# EAGLE design USB_LCD (EAGLE 5.10)
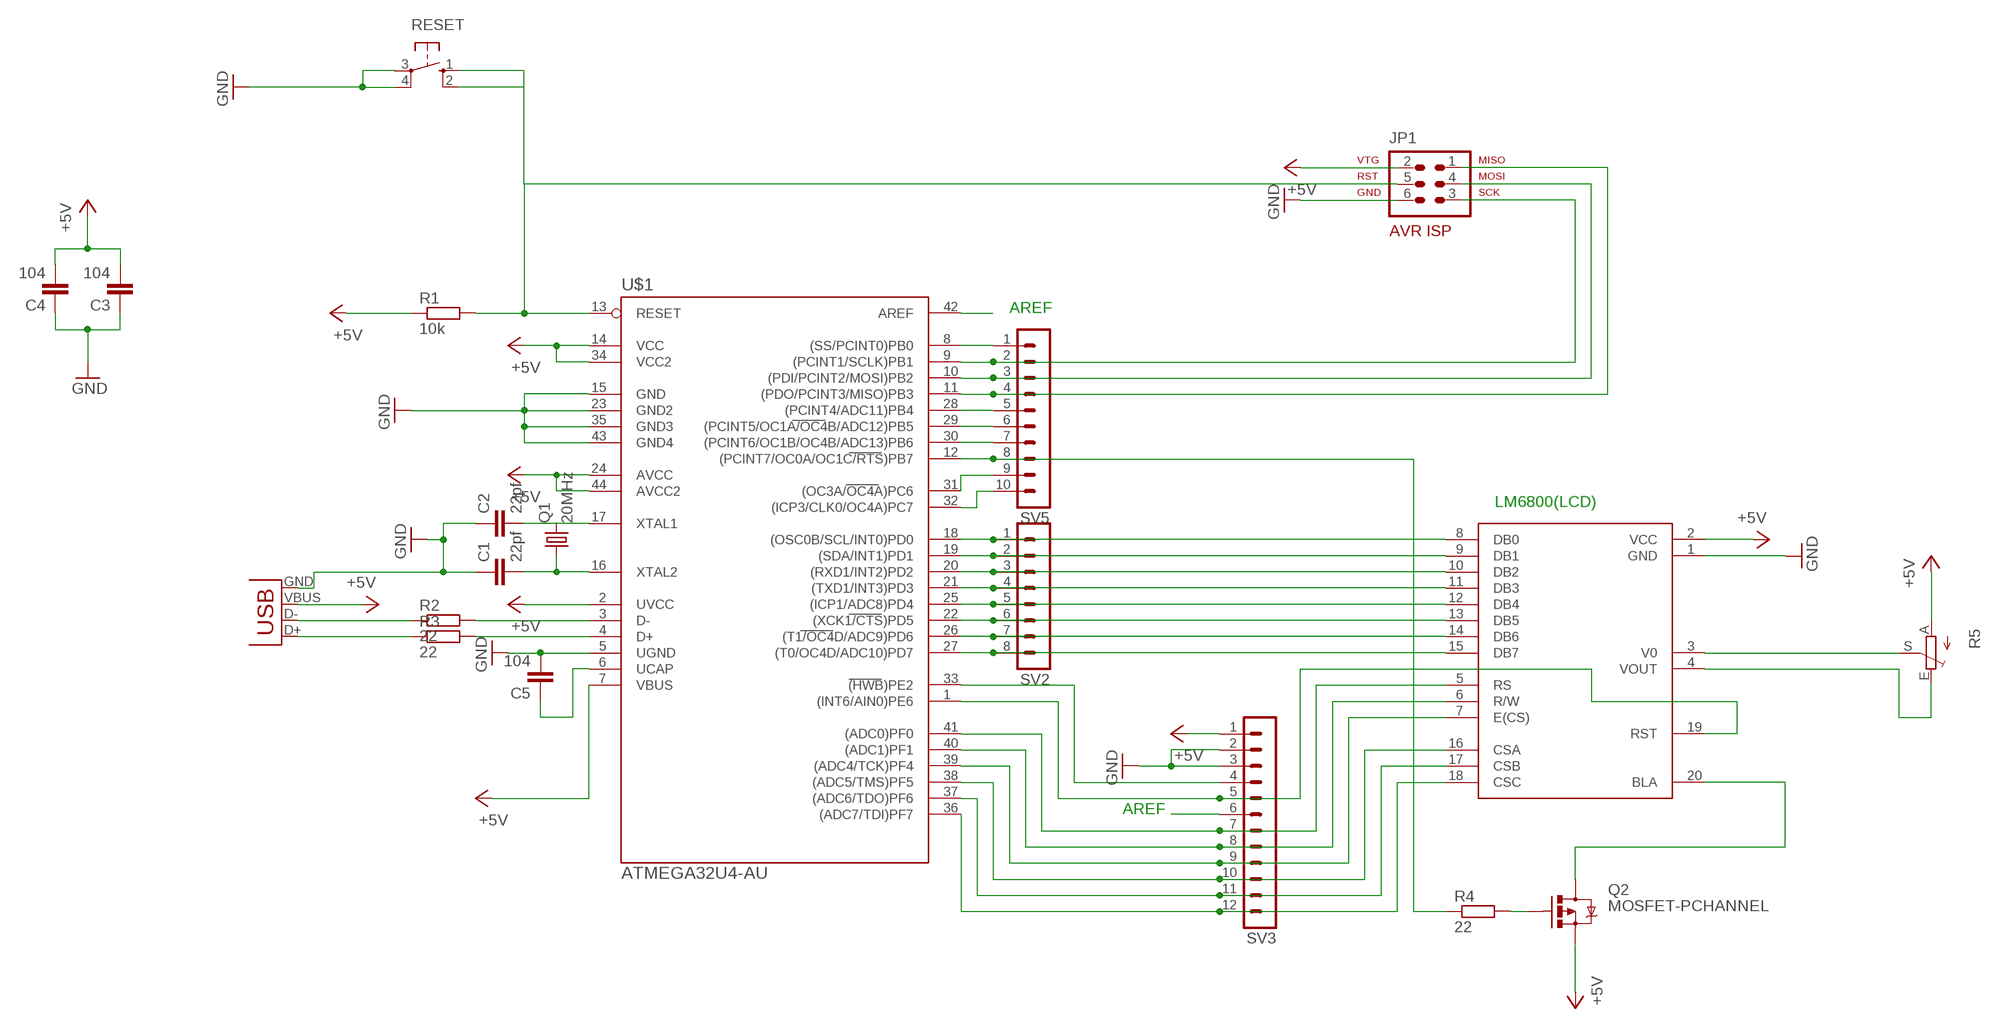
[diagram p0: schematic, sheet 1]

## Parts
C1  22pf  C5/3  [C5B3]
C2  22pf  C5/3  [C5B3]
C3  104  C5/3  [C5B3]
C4  104  C5/3  [C5B3]
C5  104  C5/3  [C5B3]
JP1  AVR-ISP-6  [AVR-ISP-6]
LM6800  LM6800  [MA10-2]
Q1  20MHz  CRYSTALHC49S  [HC49/S]
Q2  MOSFET-PCHANNEL  [SOT23]
R1  10k  R-EU_0204/7  [0204/7]
R2  22  R-EU_0204/7  [0204/7]
R3  22  R-EU_0204/7  [0204/7]
R4  22  R-EU_0204/7  [0204/7]
R5  TRIM_EU-  [3306W]
RESET  10-XX  [B3F-10XX]
SV2  MA08-1  [MA08-1]
SV3  MA12-1  [MA12-1]
SV5  MA10-1  [MA10-1]
U$1  ATMEGA32U4-AU  [TQFP44]
X1  USB-MB-H  [USB-MB-H]

## Nets
+5V: C3.2 C4.2 JP1.2 LM6800.2(VCC) Q2.2(S) R1.1 R5.A SV3.1 U$1.2(UVCC) U$1.7(VBUS) U$1.14(VCC) U$1.24(AVCC) U$1.34(VCC2) U$1.44(AVCC2) X1.VBUS
AREF: SV3.6 U$1.42(AREF)
GND: C1.1 C2.1 C3.1 C4.1 C5.2 JP1.6 LM6800.1(GND) RESET.3(P) RESET.4(P1) SV3.2 SV3.3 U$1.5(UGND) U$1.15(GND) U$1.23(GND2) U$1.35(GND3) U$1.43(GND4) X1.GND
N$1: LM6800.8(DB0) SV2.1 U$1.18((OSC0B/SCL/INT0)PD0)
N$2: LM6800.9(DB1) SV2.2 U$1.19((SDA/INT1)PD1)
N$3: LM6800.10(DB2) SV2.3 U$1.20((RXD1/INT2)PD2)
N$4: LM6800.11(DB3) SV2.4 U$1.21((TXD1/INT3)PD3)
N$5: LM6800.12(DB4) SV2.5 U$1.25((ICP1/ADC8)PD4)
N$6: LM6800.13(DB5) SV2.6 U$1.22((XCK1/CTS)PD5)
N$7: LM6800.14(DB6) SV2.7 U$1.26((T1/OC4D/ADC9)PD6)
N$8: LM6800.15(DB7) SV2.8 U$1.27((T0/OC4D/ADC10)PD7)
N$9: SV5.1 U$1.8((SS/PCINT0)PB0)
N$10: JP1.3 SV5.2 U$1.9((PCINT1/SCLK)PB1)
N$11: JP1.4 SV5.3 U$1.10((PDI/PCINT2/MOSI)PB2)
N$12: R4.1 SV5.8 U$1.12((PCINT7/OC0A/OC1C/RTS)PB7)
N$13: SV5.5 U$1.28((PCINT4/ADC11)PB4)
N$14: SV5.6 U$1.29((PCINT5/OC1A/OC4B/ADC12)PB5)
N$15: SV5.9 U$1.31((OC3A/OC4A)PC6)
N$16: JP1.5 R1.2 RESET.1(S) RESET.2(S1) U$1.13(RESET)
N$17: JP1.1 SV5.4 U$1.11((PDO/PCINT3/MISO)PB3)
N$18: R2.1 X1.D-
N$19: C2.2 Q1.2 U$1.17(XTAL1)
N$20: C1.2 Q1.1 U$1.16(XTAL2)
N$21: R3.1 X1.D+
N$22: R2.2 U$1.3(D-)
N$23: R3.2 U$1.4(D+)
N$24: SV5.7 U$1.30((PCINT6/OC1B/OC4B/ADC13)PB6)
N$25: SV5.10 U$1.32((ICP3/CLK0/OC4A)PC7)
N$26: LM6800.18(CSC) SV3.12 U$1.36((ADC7/TDI)PF7)
N$27: LM6800.17(CSB) SV3.11 U$1.37((ADC6/TDO)PF6)
N$28: LM6800.16(CSA) SV3.10 U$1.38((ADC5/TMS)PF5)
N$29: LM6800.7(E(CS)) SV3.9 U$1.39((ADC4/TCK)PF4)
N$30: LM6800.6(R/W) SV3.8 U$1.40((ADC1)PF1)
N$31: LM6800.5(RS) SV3.7 U$1.41((ADC0)PF0)
N$32: Q2.1(G) R4.2
N$33: SV3.4 U$1.33((HWB)PE2)
N$34: LM6800.4(VOUT) R5.E
N$35: LM6800.3(V0) R5.S
N$36: LM6800.20(BLA) Q2.3(D)
N$37: C5.1 U$1.6(UCAP)
N$38: LM6800.19(RST) SV3.5 U$1.1((INT6/AIN0)PE6)

## Notes on the sheet
- AREF
- LM6800(LCD)
- AREF

## Library data of the parts
C1-C5 = capacitor-wima:C: CAPACITOR naming: grid - package width
JP1 = atmel-isp:AVR-ISP-6: AVR ISP-6 Serial Programming Header
LM6800 = LM6800:LM6800: Topway LM6800 LCD (256x64)
Q1 = crystal:CRYSTAL: CRYSTAL
Q2 = SparkFun:MOSFET-PCHANNEL
R1-R4 = resistor:R-EU_: RESISTOR, European symbol
R5 = pot:TRIM_EU-: POTENTIOMETER
RESET = switch-omron:10-XX: OMRON SWITCH
SV2 = con-lstb:MA08-1: PIN HEADER
SV3 = con-lstb:MA12-1: PIN HEADER
SV5 = con-lstb:MA10-1: PIN HEADER
U$1 = mega32U4:ATMEGA32U4-AU
X1 = SparkFun:USB: USB Connectors USB-B-PTH is fully proven SKU : PRT-00139 USB-miniB is fully proven SKU : PRT-00587 USB-A-PCB is untested. USB-A-H is throughly reviewed, but untested. Spark Fun Electronics SKU : PRT-00437 USB-B-SMT is throughly reviewed, but untested. Needs silkscreen touching up. USB-A-S has not been used/tested USB-MB-H has not been used/tested

## Board
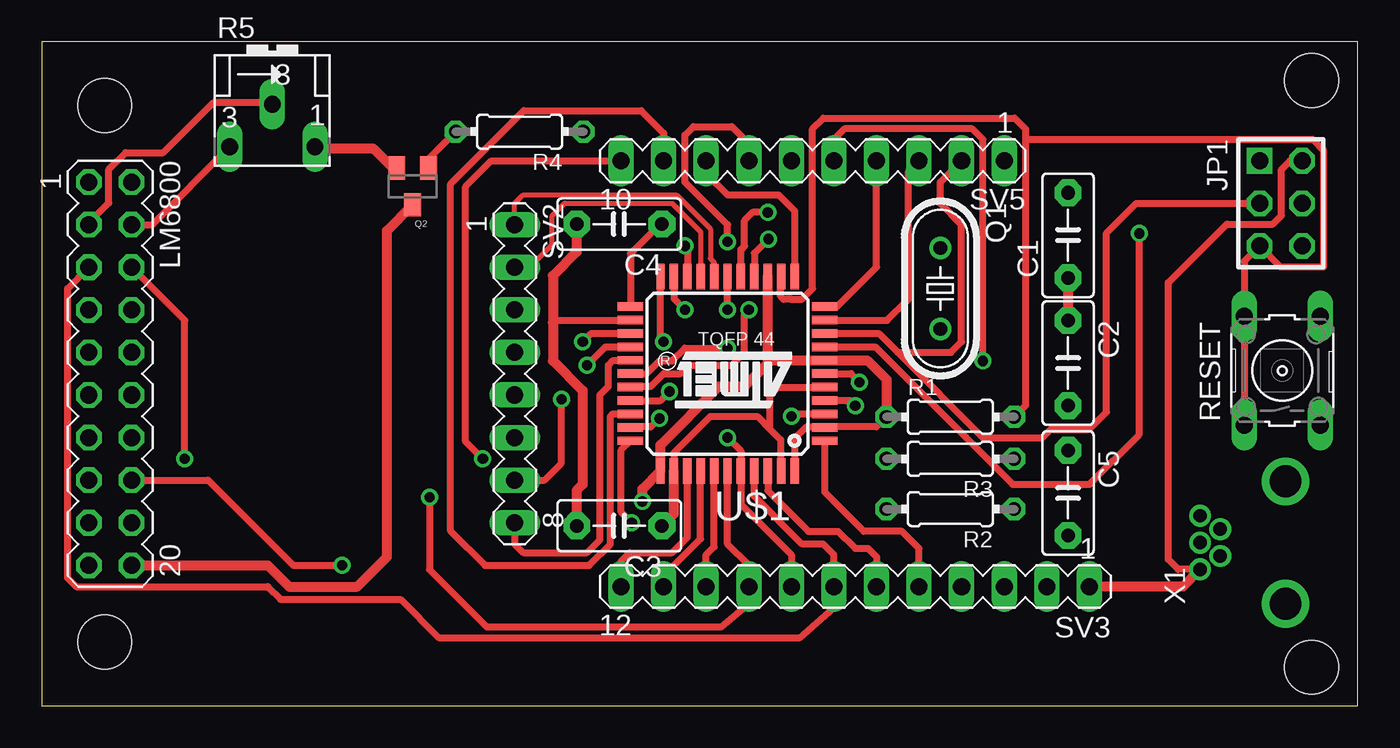
[diagram p1: board, top side]
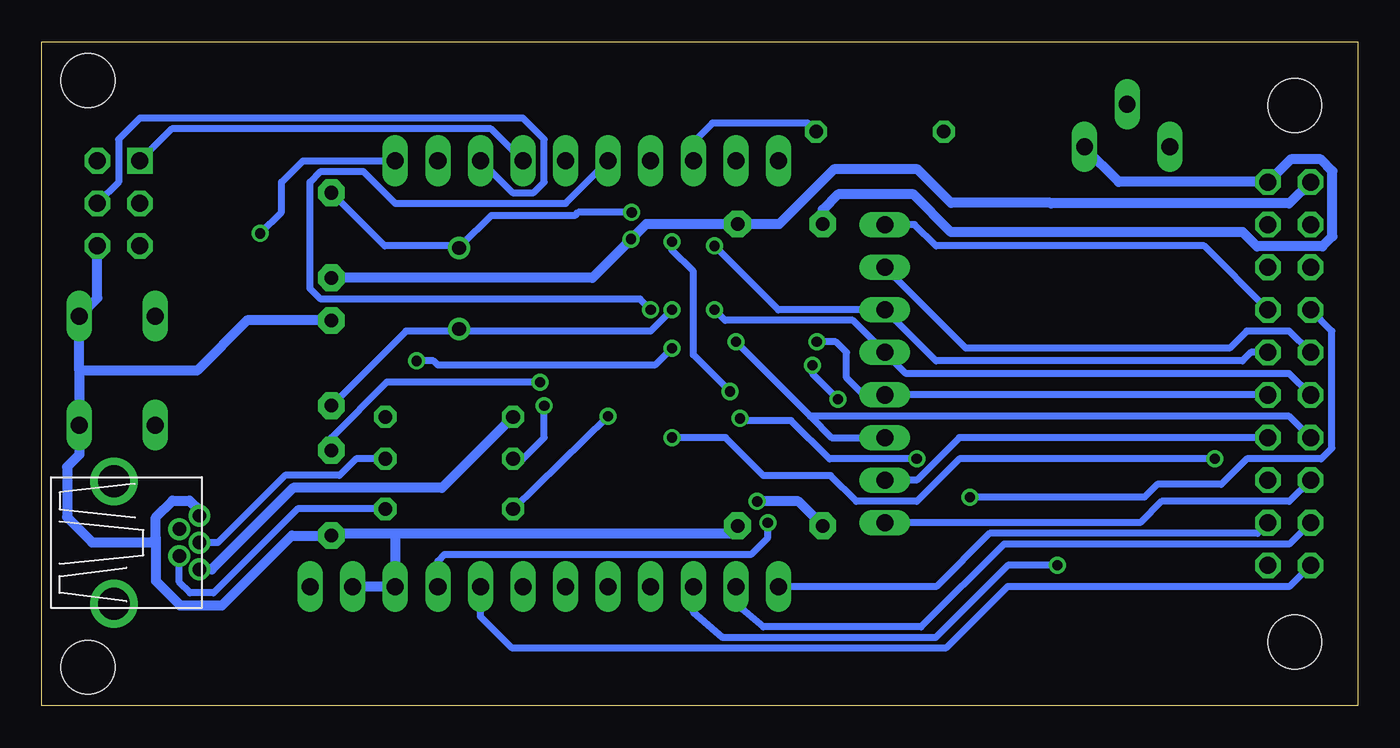
[diagram p2: board, bottom side, seen from below]

Size 78.5 x 39.6 mm. Coordinates in mm from the lower left corner, seen from the top.
Outline: 0,0 78.5,0 78.5,39.6 0,39.6 0,0
Copper layers (1*16): Top 0.035mm / dielectric 1.5mm / Bottom 0.035mm
Design rules "default *": minimum track width 10mil, minimum drill 24mil, track to track 6mil, track to pad 6mil, pad to pad 6mil, via to via 6mil, smd to smd 6mil, copper to edge 40mil, drill to drill 8mil, minimum pad ring 10mil, minimum via ring 8mil, stop-mask expansion 4mil, vias tented up to drill 0mil, thermal gap 10mil
Holes 3.2 mm at 3.75,3.8 3.75,35.8 75.75,2.3 75.75,37.3

### Footprints (pad centres in the part's own frame; a part is rotated, then mirrored left to right if it is on the bottom)
C5B3 = drill 0.813 pad 1.6 octagon: 1 -2.54,0; 2 2.54,0
AVR-ISP-6 = drill 1.016 square: 1 -2.54,-1.27 | drill 1.016 octagon: 2 -2.54,1.27; 3 0,-1.27; 4 0,1.27; 5 2.54,-1.27; 6 2.54,1.27
MA10-2 = drill 1.016 octagon: 1 -11.43,-1.27; 2 -11.43,1.27; 3 -8.89,-1.27; 4 -8.89,1.27; 5 -6.35,-1.27; 6 -6.35,1.27; 7 -3.81,-1.27; 8 -3.81,1.27; 9 -1.27,-1.27; 10 -1.27,1.27; 11 1.27,-1.27; 12 1.27,1.27; 13 3.81,-1.27; 14 3.81,1.27; 15 6.35,-1.27; 16 6.35,1.27; 17 8.89,-1.27; 18 8.89,1.27; 19 11.43,-1.27; 20 11.43,1.27
HC49/S = drill 0.813 round: 1 -2.413,0; 2 2.413,0
SOT23 = smd 1 x 1.4: 1 -0.95,-1.1; 2 0.95,-1.1; 3 0,1.1
0204/7 = drill 0.813 octagon: 1 -3.81,0; 2 3.81,0
3306W = drill 1 long: A 2.54,-1.905; E -2.54,-1.905; S 0,0.635
B3F-10XX = drill 1.016 long: 1 -3.251,2.261; 2 3.251,2.261; 3 -3.251,-2.261; 4 3.251,-2.261
MA08-1 = drill 1.016 long: 1 -8.89,0; 2 -6.35,0; 3 -3.81,0; 4 -1.27,0; 5 1.27,0; 6 3.81,0; 7 6.35,0; 8 8.89,0
MA12-1 = drill 1.016 long: 1 -13.97,0; 2 -11.43,0; 3 -8.89,0; 4 -6.35,0; 5 -3.81,0; 6 -1.27,0; 7 1.27,0; 8 3.81,0; 9 6.35,0; 10 8.89,0; 11 11.43,0; 12 13.97,0
MA10-1 = drill 1.016 long: 1 -11.43,0; 2 -8.89,0; 3 -6.35,0; 4 -3.81,0; 5 -1.27,0; 6 1.27,0; 7 3.81,0; 8 6.35,0; 9 8.89,0; 10 11.43,0
TQFP44 = smd 1.5 x 0.5: 1 -5.8,4; 2 -5.8,3.2; 3 -5.8,2.4; 4 -5.8,1.6; 5 -5.8,0.8; 6 -5.8,0; 7 -5.8,-0.8; 8 -5.8,-1.6; 9 -5.8,-2.4; 10 -5.8,-3.2; 11 -5.8,-4; 23 5.8,-4; 24 5.8,-3.2; 25 5.8,-2.4; 26 5.8,-1.6; 27 5.8,-0.8; 28 5.8,0; 29 5.8,0.8; 30 5.8,1.6; 31 5.8,2.4; 32 5.8,3.2; 33 5.8,4 | smd 0.5 x 1.5: 12 -4,-5.8; 13 -3.2,-5.8; 14 -2.4,-5.8; 15 -1.6,-5.8; 16 -0.8,-5.8; 17 0,-5.8; 18 0.8,-5.8; 19 1.6,-5.8; 20 2.4,-5.8; 21 3.2,-5.8; 22 4,-5.8; 34 4,5.8; 35 3.2,5.8; 36 2.4,5.8; 37 1.6,5.8; 38 0.8,5.8; 39 0,5.8; 40 -0.8,5.8; 41 -1.6,5.8; 42 -2.4,5.8; 43 -3.2,5.8; 44 -4,5.8
USB-MB-H = drill 0.8 round: D+ 5.1,0; D- 3.9,0.8; GND 5.1,-1.6; ID 3.9,-0.8; VBUS 5.1,1.6 | drill 1.9 round: P$6 0,-3.65; P$7 0,3.65

### Placement (x,y rotation side)
C1  61.23,28.07 90 top
C2  61.23,20.45 270 top
C3  34.45,10.74 180 top
C4  34.45,28.74 180 top
C5  61.23,12.7 270 top
JP1  73.93,29.97 270 top
LM6800  4.08,19.81 270 top
Q1  53.61,24.89 270 top
Q2  22.12,30.99 180 top
R1  54.2,17.24 0 top
R2  54.2,11.74 180 top
R3  54.2,14.74 180 top
R4  28.5,34.25 180 top
R5  13.75,35.25 0 top
RESET  74,20 90 top
SV2  28.21,19.81 270 top
SV3  48.53,7.11 180 top
SV5  45.99,32.51 180 top
U$1  40.91,19.81 180 top
X1  74.2,9.74 180 top

### Tracks (layer width: path | path; a pad name or v marks a point on that pad's centre or on a via)
+5V  (via drill 0.61)
  Top 0.254: 34.56,22.99 U$1.24 | 47.26,16.64 U$1.2
  Top 0.406: 46.68,16.64 U$1.2 45.58,16.61 44.91,15.94 U$1.44 | 47.26,16.64 49.79,16.64 R1.1 50.3,17.32 | X1.VBUS 67.8,8.14 67.2,8.74 67.2,25.24 70.7,28.74 73.45,28.74 73.95,29.24 73.95,31.99 74.45,32.49 75.17,32.49 JP1.2 | 34.56,22.99 30.62,22.99 30.49,22.86
  Top 0.61: 43.31,20.43 U$1.14 | 43.31,20.43 41.92,19.05 40.4,19.05 36.91,15.56 U$1.34 35.83,12.93 v35.83,12.19 | 43.31,20.43 43.48,20.61 U$1.7 49.25,20.61 50.39,19.47 R1.1 | C3.2 31.91,12.85 32.27,13.21 32.27,18.8 30.49,20.57 30.49,22.86 30.49,25.65 31.91,27.07 C4.2 | SV3.1 68.07,7.11 X1.VBUS | Q2.2 20.91,32.09 19.75,33.25 16.38,33.25 R5.A
  Bottom 0.61: v35.83,12.19 33.36,12.19 C3.2 | C4.2 31.91,29.59 31,30.5 26.5,30.5 24.25,28.25 6.85,28.25 6,27.4 2.1,27.4 1.5,28 1.5,31.9 2.2,32.6 3.99,32.6 LM6800.2 14.25,31.25 16.29,33.29 R5.A | X1.VBUS 68.36,8.14 63.5,13 54.63,13 R1.1
AREF
  Top 0.406: U$1.42 43.31,12.84 45.73,10.41 47.51,10.41 48.53,9.4 49.29,9.4 49.8,8.89 SV3.6
GND  (via drill 0.61)
  Top 0.254: 44.08,14.1 U$1.43 | U$1.35 37.73,14.1
  Top 0.406: U$1.5 43.92,19.01 43.45,18.54 43.45,16.51 | U$1.23 35.11,26.97 36.88,28.74 C4.1 | 37.73,14.1 37.73,15.11 39.89,17.27 42.68,17.27 43.45,16.51 | 44.08,14.1 44.08,15.88 43.45,16.51 | U$1.15 42.51,27 v43.35,27.84
  Top 0.61: U$1.35 37.71,11.45 C3.1 | C1.1 C2.1
  Bottom 0.406: JP1.6
  Bottom 0.61: LM6800.1 4.08,29.97 18.3,29.97 18.33,30 24.25,30 26.25,32 31.25,32 32.26,30.99 32.27,30.99 34.52,28.74 C4.1 42.45,28.74 v43.35,27.84 45.66,25.53 C1.1 | X1.GND 69.1,11.64 69.7,12.24 70.7,12.24 71.7,11.24 71.7,10 | C3.1 37.44,10.29 57.42,10.29 | 57.42,10.29 SV3.3 SV3.2 | 71.7,10 71.7,7.45 70.25,6 67.75,6 63.59,10.16 C5.2 61.1,10.29 57.42,10.29 | JP1.6 75.2,24.32 RESET.4 76.26,20 | 76.26,20 RESET.3 76.26,14.99 77,14.25 77,11.25 75.5,9.75 71.95,9.75 71.7,10 | C2.1 66.26,22.99 69.25,20 76.26,20
N$1
  Top 0.305: SV2.1 28.21,29.97 28.71,30.48 37.86,30.48 39.89,28.45 39.89,26.67 40.11,26.45 U$1.18
  Bottom 0.406: SV2.1 26.43,28.7 25.16,27.43 9.16,27.43 LM6800.8
N$2
  Top 0.305: 31.18,29.97 31.2,29.99 | SV2.2 28.28,26.24 29.2,26.24 30.45,27.49 30.45,29.24 31.18,29.97 | U$1.19 39.31,28.27 37.6,29.97 31.18,29.97
  Bottom 0.406: LM6800.9 4.08,22.35 6.62,22.35 7.63,21.34 23.38,21.34 SV2.2
N$3  (via drill 0.61)
  Top 0.406: U$1.20 38.51,27.29 v38.37,27.43
  Bottom 0.406: v38.37,27.43 34.56,23.62 SV2.3 25.16,20.57 6.87,20.57 6.36,21.08 LM6800.10
N$4  (via drill 0.61)
  Top 0.254: 37.73,25.53 U$1.21
  Top 0.406: 37.73,25.53 37.73,24.26 v38.37,23.62
  Bottom 0.406: v38.37,23.62 37.73,22.99 30.11,22.99 SV2.4 26.94,19.81 4.08,19.81 LM6800.11
N$5  (via drill 0.61)
  Top 0.406: U$1.25 32.77,22.21 v32.27,21.72
  Bottom 0.406: LM6800.12 SV2.5 29.48,18.54 30.49,19.56 30.49,21.08 31.13,21.72 v32.27,21.72
N$6  (via drill 0.61)
  Top 0.406: U$1.22 36.91,21.91 v37.1,21.72
  Bottom 0.406: 32.65,17.27 31.38,16 SV2.6 | 32.65,17.27 v37.1,21.72 | LM6800.13 4.08,17.27 32.65,17.27
N$7  (via drill 0.61)
  Top 0.406: v31,18.29 31,14.48 29.98,13.46 SV2.7 | U$1.26 33.62,21.41 v32.52,20.32
  Bottom 0.406: LM6800.14 23.76,16 26.3,13.46 SV2.7 | v32.52,20.32 32.52,19.81 v31,18.29
N$8
  Top 0.406: U$1.27 34.09,20.61 33.79,20.32 33.79,19.05 33.29,18.54 33.29,9.91 32.52,9.14 28.71,9.14 28.21,9.65 SV2.8
  Bottom 0.406: LM6800.15 4.08,12.19 11.7,12.19 12.97,10.92 SV2.8
N$9  (via drill 0.61)
  Top 0.406: v65.47,28.18 65.47,16.18 62.5,13.21 57.92,13.21 49.72,21.41 U$1.8
  Bottom 0.406: SV5.1 62.93,32.51 64.2,31.24 64.2,29.45 v65.47,28.18
N$10
  Top 0.406: SV5.2 53.61,31.24 53.61,29.97 54.88,28.7 54.88,21.72 54.24,21.08 51.07,21.08 | U$1.9 49.94,22.21 51.07,21.08 | 51.07,21.08 56.15,16 59.7,16 60.21,16.51 62.5,16.51 63.51,17.53 63.51,28.19 65.29,29.97 JP1.3
N$11
  Top 0.254: U$1.10 47.26,22.99
  Top 0.406: 47.26,22.99 50.43,22.99 51.7,24.26 51.7,31.88 SV5.3
  Bottom 0.406: JP1.4 73.93,31.24 73.93,33.78 72.66,35.05 49.8,35.05 48.53,33.78 48.53,31.24 49.16,30.61 50.43,30.61 SV5.3
N$12
  Top 0.406: U$1.12 44.91,29.53 43.95,30.48 40.91,30.48 39.64,31.75 SV5.8
  Bottom 0.406: SV5.8 39.64,33.61 38.5,34.75 32.81,34.75 R4.1
N$13  (via drill 0.61)
  Top 0.406: v56.15,20.57 56.15,33.78 55.51,34.42 47.89,34.42 47.26,33.78 SV5.5 | v40.91,21.34 38.37,21.34 37.6,20.57 36.84,20.57 36.08,19.81 U$1.28
  Bottom 0.406: v56.15,20.57 55.13,20.57 54.88,20.32 41.92,20.32 v40.91,21.34
N$14  (via drill 0.61)
  Top 0.406: v42.18,23.62 41.92,23.37 41.92,21.08 41.16,20.32 38.62,20.32 38.11,19.81 37.1,19.81 36.33,19.05 35.14,19.05 U$1.29
  Bottom 0.406: v42.18,23.62 42.81,24.26 61.86,24.26 62.5,24.89 62.5,31.24 61.86,31.88 59.32,31.88 57.42,29.97 47.26,29.97 SV5.6
N$15
  Top 0.406: U$1.31 34.06,17.41 33.92,17.27 33.92,9.65 32.65,8.38 26.43,8.38 24.4,10.41 24.4,31.15 28.75,35.5 35.75,35.5 37.1,34.15 SV5.9
N$16
  Top 0.254: 44.08,24.89 44.08,25.53 U$1.13
  Top 0.406: 58.69,33.78 75.83,33.78 76.47,33.15 76.47,26.16 73.93,26.16 JP1.5 71.74,26.52 RESET.2 RESET.1 | 58.69,33.78 58.69,17.91 R1.2 | 58.69,33.78 58.69,34.42 58.05,35.05 46.62,35.05 45.99,34.42 45.99,24.89 45.35,24.26 44.72,24.26 44.71,24.25 44.25,24.25 44.08,24.42 44.08,24.89
N$17
  Top 0.406: SV5.4 49.8,26.16 47.45,23.81 U$1.11
  Bottom 0.406: JP1.1 70.75,34.42 51.7,34.42 SV5.4
N$18
  Bottom 0.406: X1.D- 70.3,7.38 69.66,6.74 68.26,6.74 63.25,11.75 58.02,11.75 R2.1
N$19  (via drill 0.61)
  Top 0.406: v40.91,23.62 U$1.17
  Bottom 0.254: 53.61,22.35 Q1.2
  Bottom 0.406: v40.91,23.62 42.18,22.35 53.61,22.35 56.78,22.35 C2.2
N$20  (via drill 0.61)
  Top 0.406: v43.31,29.43 43.28,29.46 42.43,29.46 41.92,28.96 41.92,27.43 41.71,27.22 U$1.16
  Bottom 0.406: C1.2 58.05,27.43 53.73,27.43 Q1.1 53.48,27.43 53.48,27.46 51.7,29.24 46.7,29.24 46.51,29.43 v43.31,29.43
N$21
  Bottom 0.406: X1.D+ 68.01,9.74 64,13.75 60.75,13.75 59.76,14.74 R3.1
N$22  (via drill 0.61)
  Top 0.406: U$1.3 44.86,17.41 v44.72,17.27
  Bottom 0.406: R2.2 v44.72,17.27
N$23  (via drill 0.61)
  Top 0.406: U$1.4 48.22,18.21 v48.53,17.91
  Bottom 0.406: v48.53,17.91 48.53,16 49.8,14.73 R3.2
N$24  (via drill 0.61)
  Top 0.406: SV5.7 42.18,33.53 41.16,34.54 38.87,34.54 38.37,34.04 38.37,31.24 40.91,28.7 v40.91,27.69 | U$1.30 36.91,18.21 v37.45,18.75
  Bottom 0.406: v40.91,27.69 40.91,27.18 39.64,25.91 39.64,20.94 v37.45,18.75
N$25  (via drill 0.61)
  Top 0.254: 35.19,16.64 U$1.32
  Top 0.406: v26.3,14.73 25.29,15.75 25.29,30.99 26.81,32.51 SV5.10 | 35.19,16.64 36.33,16.64 v36.84,17.14
  Bottom 0.406: v26.3,14.73 31.51,14.73 33.79,17.02 36.72,17.02 v36.84,17.14
N$26
  Top 0.406: U$1.36 38.51,10.05 37.6,9.14 35.06,9.14 34.56,8.64 SV3.12
  Bottom 0.406: LM6800.18 5.98,10.29 21.96,10.29 25.14,7.11 SV3.12
N$27
  Top 0.406: U$1.37 39.31,9.96 37.1,7.75 SV3.11
  Bottom 0.406: LM6800.17 4.08,9.65 21.1,9.65 26.04,4.71 35.46,4.71 37.1,6.1 SV3.11
N$28  (via drill 0.61)
  Top 0.406: U$1.38 40.11,9.49 39.64,9.02 SV3.10 | v17.92,8.38 15,8.38 9.92,13.46 LM6800.16
  Bottom 0.406: SV3.10 39.64,5.59 37.87,4.07 25.18,4.07 20.87,8.38 v17.92,8.38
N$29  (via drill 0.61)
  Top 0.406: U$1.39 40.91,9.65 42.18,8.38 SV3.9 42.18,6.1 40.54,4.71 26.54,4.71 23.13,8.12 v23.13,12.45
  Bottom 0.406: LM6800.7 1.54,22.35 1.54,15.37 2.17,14.73 6.62,14.73 8.14,13.21 11.95,13.21 12.71,12.45 v23.13,12.45
N$30  (via drill 0.61)
  Top 0.406: v40.91,16 41.71,15.2 U$1.40 41.71,12.03 44.72,9.02 SV3.8 | v8.52,14.73 8.52,22.99 LM6800.6
  Bottom 0.406: v8.52,14.73 23.76,14.73 26.3,12.19 29.9,12.19 31.45,13.74 35.45,13.74 37.71,16 v40.91,16
N$31
  Top 0.406: U$1.41 42.51,12.5 45.35,9.65 46.62,9.65 47.26,9.02 SV3.7 47.26,5.84 45.24,4.07 23.68,4.07 21.4,6.35 14.24,6.35 13.47,7.11 2.04,7.11 1.54,7.62 1.54,24.89 LM6800.5
N$32
  Top 0.406: Q2.1 23.07,32.63 R4.2
N$33  (via drill 0.61)
  Top 0.406: U$1.33 34.56,15.26 34.56,11.56 v35.19,10.92
  Bottom 0.406: v35.19,10.92 35.19,10.03 36.21,9.02 54.49,9.02 54.88,8.64 SV3.4
N$34
  Top 0.406: LM6800.4 6.57,28.7 R5.E
N$35
  Top 0.406: LM6800.3 2.81,28.81 4,30 4,32 5,33 7.25,33 10.25,36 13.63,36 R5.S
N$36
  Top 0.61: LM6800.20 13.47,8.38 14.74,7.11 18.81,7.11 20.59,8.89 20.59,28.35 Q2.3
N$37  (via drill 0.61)
  Top 0.406: U$1.6 48.27,19.81 v48.78,19.3
  Bottom 0.406: v48.78,19.3 57.92,19.3 61.23,16 C5.1
N$38
  Top 0.406: U$1.1 46.71,12.74 49.03,10.41 51.32,10.41 52.34,9.4 SV3.5
  Bottom 0.406: LM6800.19 4.08,7.11 20.89,7.11 24.56,3.44 50.44,3.44 52.34,5.33 SV3.5